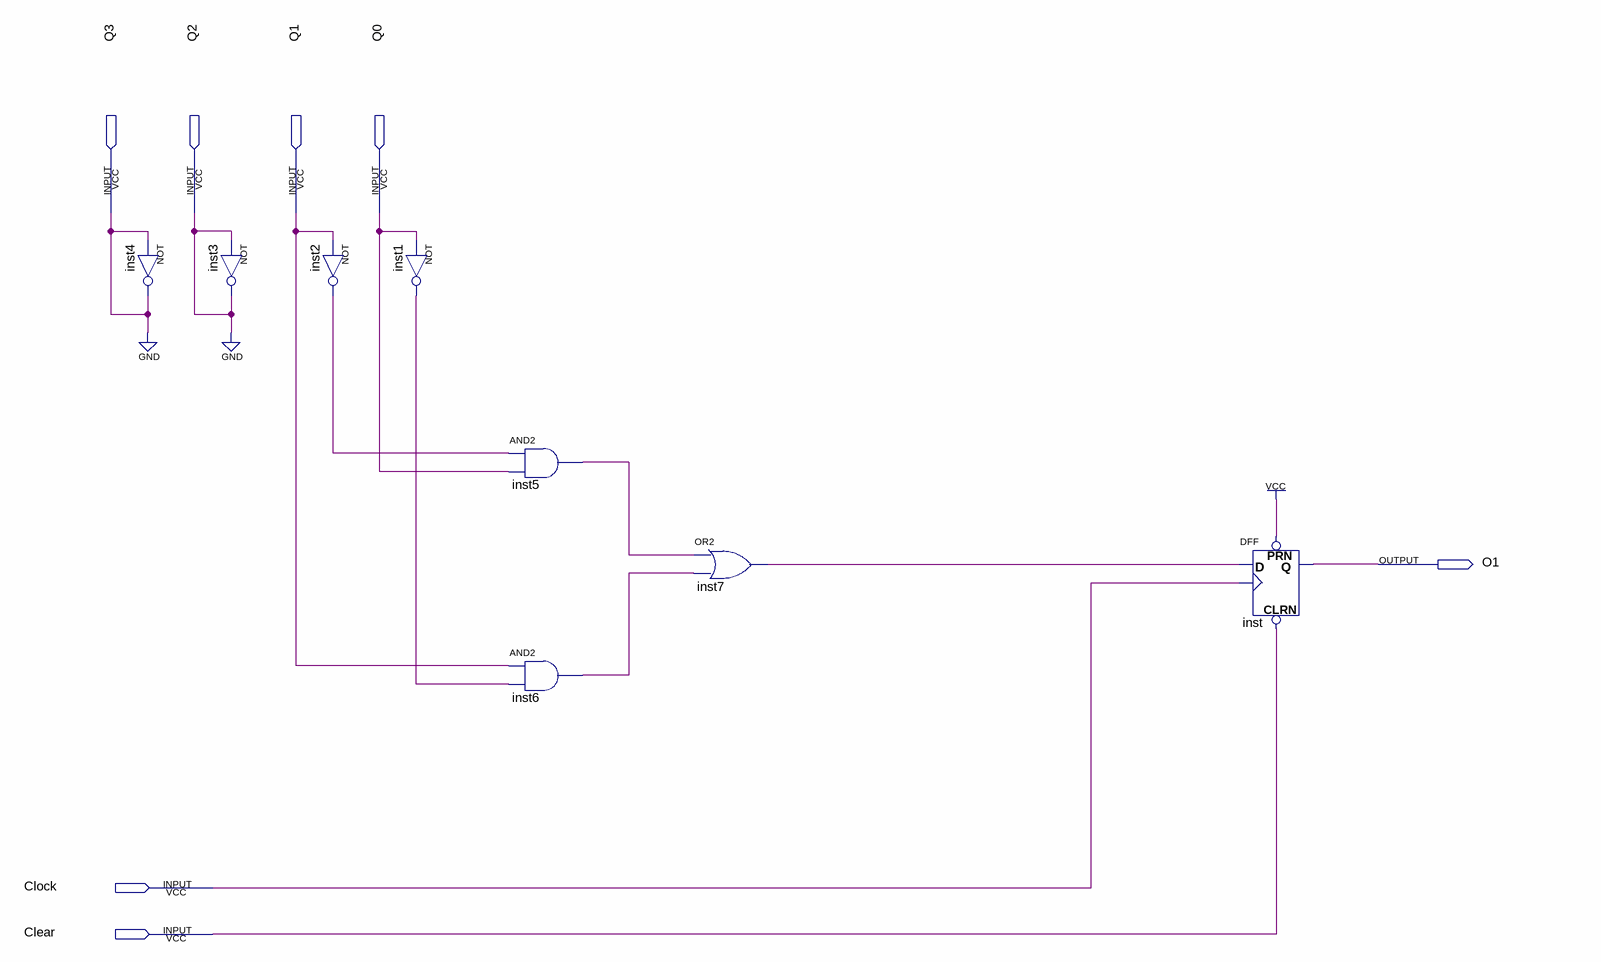
[diagram p0: schematic sheet]
// Quartus schematic D1.bdf as structural Verilog: 8 symbols, 7 pins
module D1 (
  input  Q3,
  input  Q2,
  input  Q1,
  input  Q0,
  input  Clock,
  input  Clear,
  output O1
);

  wire inst1_out, inst2_out, inst5_out, inst6_out, inst7_out;

  not inst4 (Q3, Q3);
  not inst3 (Q2, Q2);
  not inst2 (inst2_out, Q1);
  not inst1 (inst1_out, Q0);
  and inst5 (inst5_out, inst2_out, Q0);
  and inst6 (inst6_out, Q1, inst1_out);
  or inst7 (inst7_out, inst5_out, inst6_out);
  DFF inst (.CLRN(Clear), .CLK(Clock), .D(inst7_out), .PRN(1'b1), .Q(O1));
  // also tied to GND on the sheet: {Q2, Q3}
endmodule
